# Altium schematic sheet STM32G4_4008_brushless_motor.SchDoc
size A3
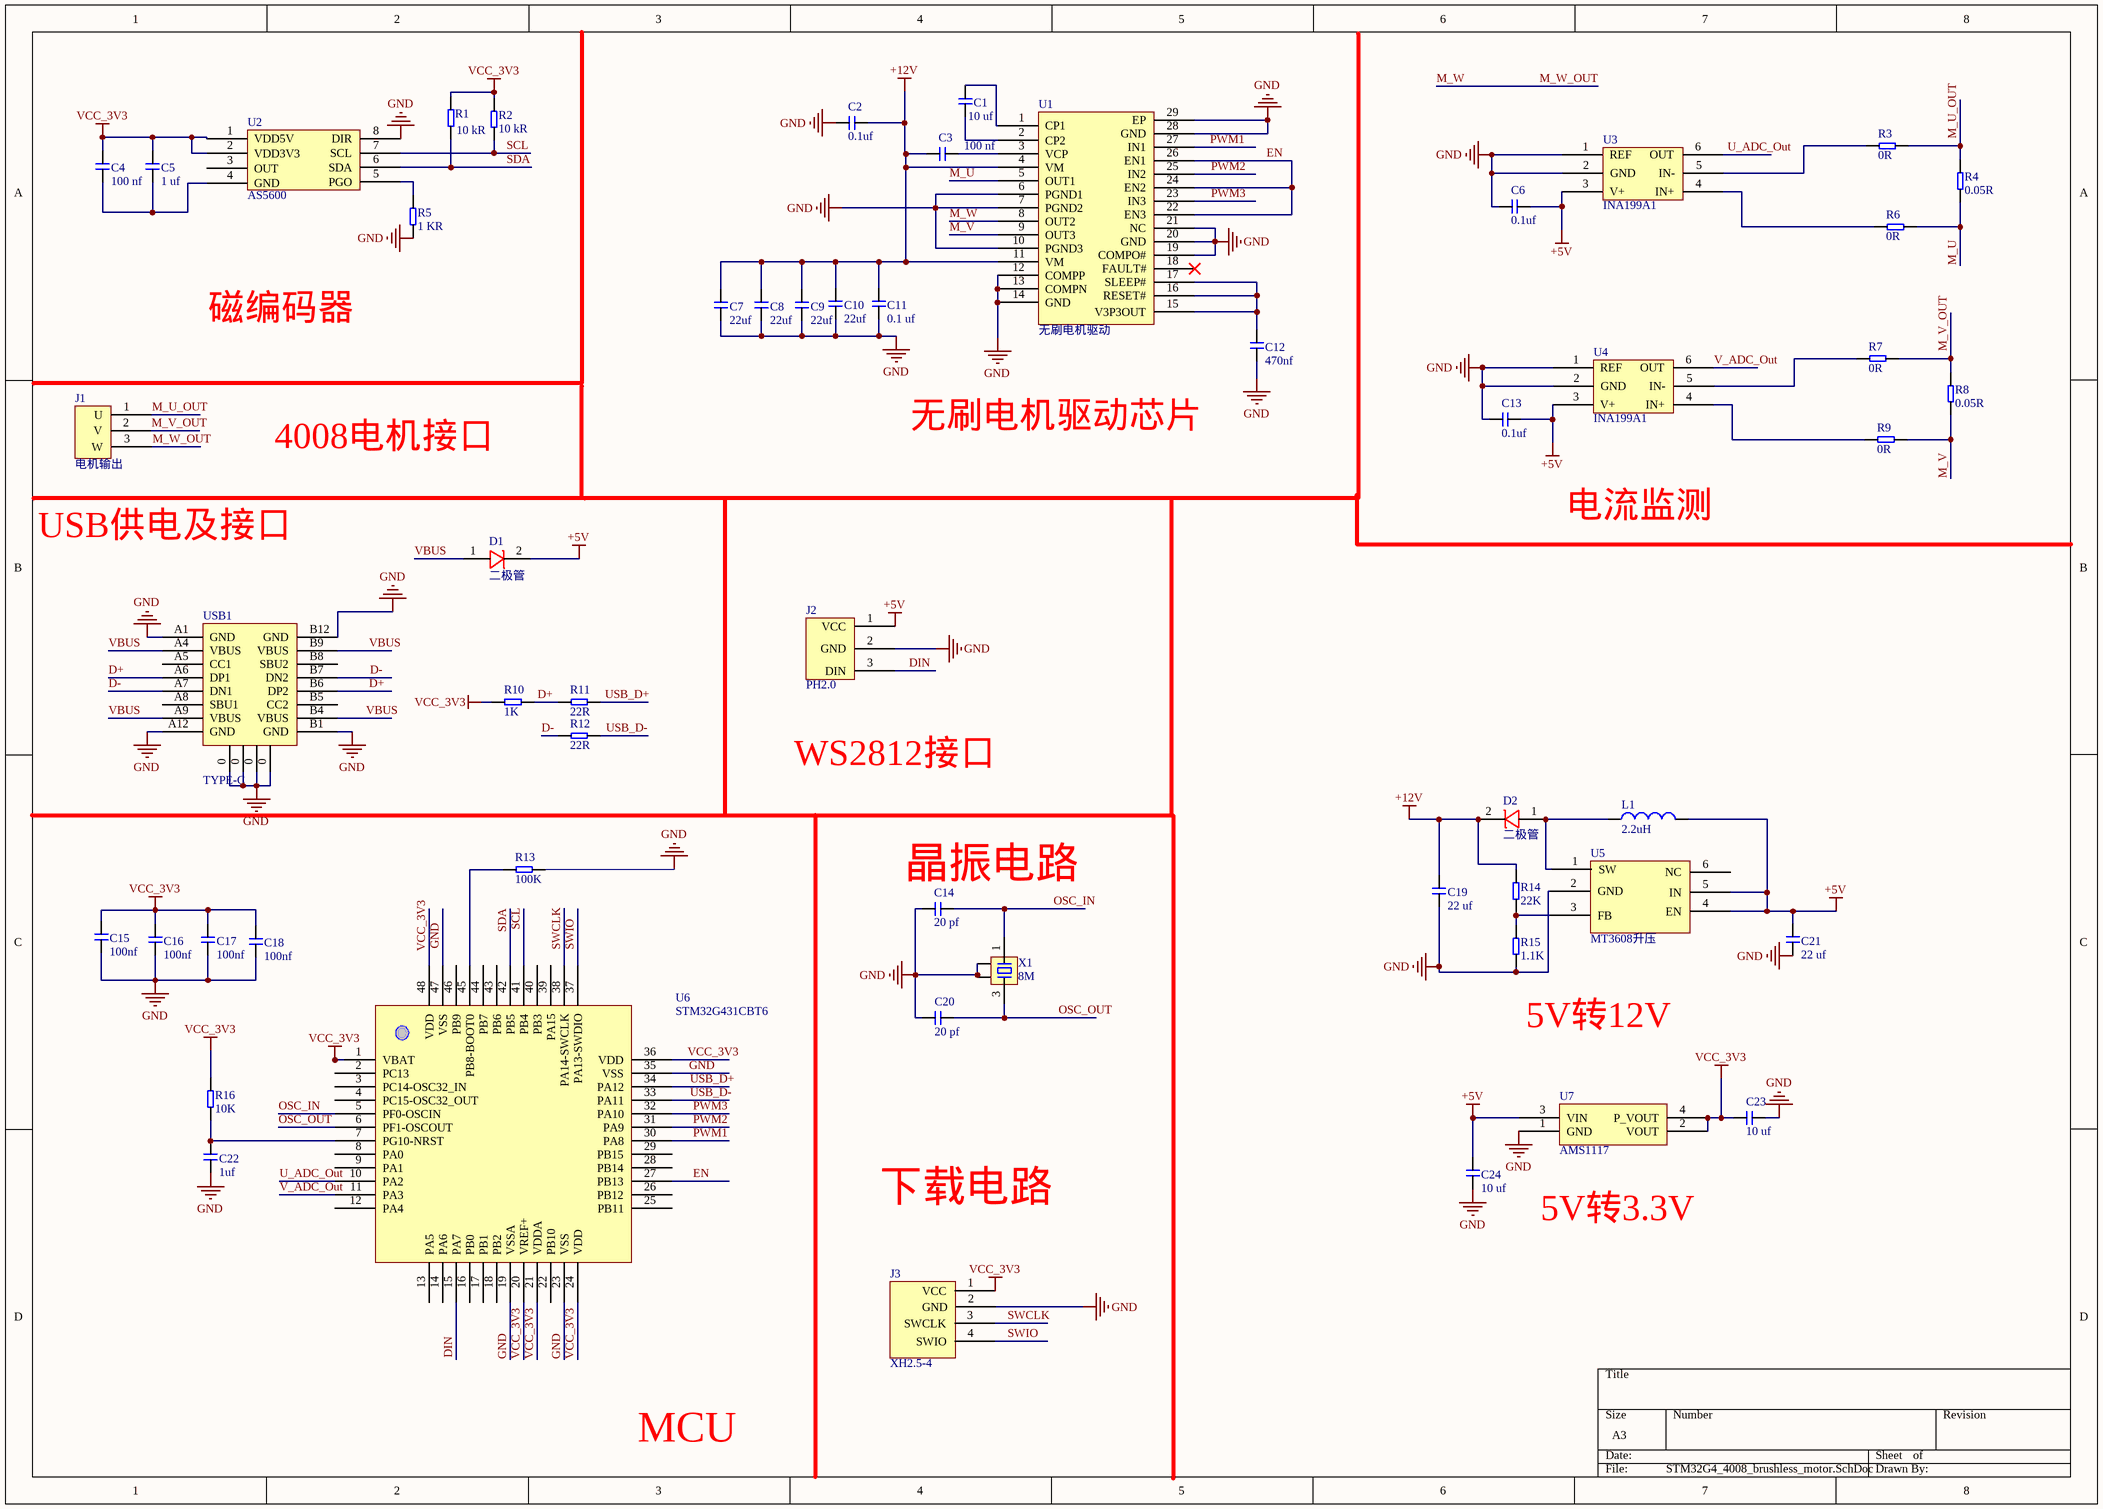
[diagram p0: STM32G4_4008_brushless_motor.SchDoc]

## Parts
C1  10 uf  [C 0603]
C2  0.1uf  [C 0603]
C3  100 nf  [C 0603]
C4  100 nf  [C 0603]
C5  1 uf  [C 0603]
C6  0.1uf  [C 0603]
C7  22uf  [C 0603]
C8  22uf  [C 0603]
C9  22uf  [C 0603]
C10  22uf  [C 0603]
C11  0.1 uf  [C 0603]
C12  470nf  [C 0603]
C13  0.1uf  [C 0603]
C14  20 pf  [C 0603]
C15  100nf  [C 0603]
C16  100nf  [C 0603]
C17  100nf  [C 0603]
C18  100nf  [C 0603]
C19  22 uf  [C 0603]
C20  20 pf  [C 0603]
C21  22 uf  [C 0603]
C22  1uf  [C 0603]
C23  10 uf  [C 0603]
C24  10 uf  [C 0603]
D1  二极管  [SMA]
D2  二极管  [SMA]
J1  电机输出  [SH1.0-WT-3P]
J2  PH2.0  [PH2.0-WI-3P]
J3  XH2.5-4  [HDR2.54-M-LI-4P]
L1  2.2uH  [L-SMD-0630]
R1  10 kR  [R 0603]
R2  10 kR  [R 0603]
R3  0R  [R 0603]
R4  0.05R  [R 2512-HP_L]
R5  1 KR  [R 0603]
R6  0R  [R 0603]
R7  0R  [R 0603]
R8  0.05R  [R 2512-HP_L]
R9  0R  [R 0603]
R10  1K  [R 0603]
R11  22R  [R 0603]
R12  22R  [R 0603]
R13  100K  [R 0603]
R14  22K  [R 0603]
R15  1.1K  [R 0603]
R16  10K  [R 0603]
U1  无刷电机驱动  [TSSOP28_n]
U2  AS5600  [SOP8_N]
U3  INA199A1  [SOT36-3N]
U4  INA199A1  [SOT36-3N]
U5  MT3608升压  [SOT23-6L]
U6  STM32G431CBT6  [TQFP48 7x7_L]
U7  AMS1117  [SOT223_N]
USB1  TYPE-C  [USB-C-SMD_TYPE-C-USB-5]
X1  8M  [OSC 3225-4P]

## Nets
+5V: C6.2 C13.2 C21.1 C24.1 D1.2 J2.1(VCC) L1.2 U3.3(V+) U4.3(V+) U5.4(EN) U5.5(IN) U7.3(VIN)
+12V: C2.2 C3.2 C7.1 C8.1 C9.1 C10.1 C11.1 C19.1 D2.2 R14.2 U1.4(VM) U1.11(VM)
GND: C2.1 C6.1 C7.2 C8.2 C9.2 C10.2 C11.2 C12.2 C13.1 C14.2 C15.2 C16.2 C17.2 C18.2 C19.2 C20.2 C21.2 C22.2 C23.1 C24.2 J2.2(GND) J3.2(GND) R5.1 R13.2 R15.1 U1.6(PGND1) U1.7(PGND2) U1.10(PGND3) U1.12(COMPP) U1.13(COMPN) U1.14(GND) U1.19(COMPO#) U1.20(GND) U1.21(NC) U1.28(GND) U1.29(EP) U2.8(DIR) U3.1(REF) U3.2(GND) U4.1(REF) U4.2(GND) U5.2(GND) U6.19(VSSA) U6.23(VSS) U6.35(VSS) U6.47(VSS) U7.1(GND) USB1.0 USB1.A1(GND) USB1.A12(GND) USB1.B1(GND) USB1.B12(GND) X1.2 X1.4
VCC_3V3: C4.1 C5.1 C15.1 C16.1 C17.1 C18.1 C23.2 J3.1(VCC) R1.2 R2.2 R10.2 R16.1 U2.1(VDD5V) U2.2(VDD3V3) U6.1(VBAT) U6.20(VREF+) U6.21(VDDA) U6.24(VDD) U6.36(VDD) U6.48(VDD) U7.2(VOUT) U7.4(P_VOUT)
D+: R10.1 R11.1 USB1.A6(DP1) USB1.B6(DP2)
D-: R12.1 USB1.A7(DN1) USB1.B7(DN2)
DIN: J2.3(DIN) U6.15(PA7)
EN: U1.22(EN3) U1.24(EN2) U1.26(EN1) U6.27(PB13)
M_U: R4.2 R6.1 U1.5(OUT1)
M_U_OUT: J1.1(U) R3.1 R4.1
M_V: R8.2 R9.1 U1.9(OUT3)
M_V_OUT: J1.2(V) R7.1 R8.1
M_W: J1.3(W) U1.8(OUT2)  [also labelled M_W_OUT]
OSC_IN: C14.1 U6.5(PF0-OSCIN) X1.1
OSC_OUT: C20.1 U6.6(PF1-OSCOUT) X1.3
PWM1: U1.27(IN1) U6.30(PA8)
PWM2: U1.25(IN2) U6.31(PA9)
PWM3: U1.23(IN3) U6.32(PA10)
SCL: R2.1 U2.7(SCL) U6.41(PB4)
SDA: R1.1 U2.6(SDA) U6.42(PB5)
SWCLK: J3.3(SWCLK) U6.38(PA14-SWCLK)
SWIO: J3.4(SWIO) U6.37(PA13-SWDIO)
U_ADC_Out: U3.6(OUT) U6.10(PA2)
USB_D+: R11.2 U6.34(PA12)
USB_D-: R12.2 U6.33(PA11)
V_ADC_Out: U4.6(OUT) U6.11(PA3)
VBUS: D1.1 USB1.A4(VBUS) USB1.A9(VBUS) USB1.B4(VBUS) USB1.B9(VBUS)
NetC1_1: C1.1 U1.1(CP1)
NetC1_2: C1.2 U1.2(CP2)
NetC3_1: C3.1 U1.3(VCP)
NetC4_2: C4.2 C5.2 U2.4(GND)
NetC12_1: C12.1 U1.15(V3P3OUT) U1.16(RESET#) U1.17(SLEEP#)
NetC22_1: C22.1 R16.2 U6.7(PG10-NRST)
NetD2_1: D2.1 L1.1 U5.1(SW)
NetR3_2: R3.2 U3.5(IN-)
NetR5_2: R5.2 U2.5(PGO)
NetR6_2: R6.2 U3.4(IN+)
NetR7_2: R7.2 U4.5(IN-)
NetR9_2: R9.2 U4.4(IN+)
NetR13_1: R13.1 U6.45(PB8-BOOT0)
NetR14_1: R14.1 R15.2 U5.3(FB)

Not connected (* = marked no-connect by the designer): U1 18(FAULT#)*; U2 3(OUT); U5 6(NC); U6 2(PC13) 3(PC14-OSC32_IN) 4(PC15-OSC32_OUT) 8(PA0) 9(PA1) 12(PA4) 13(PA5) 14(PA6) 16(PB0) 17(PB1) 18(PB2) 22(PB10) 25(PB11) 26(PB12) 28(PB14) 29(PB15) 39(PA15) 40(PB3) 43(PB6) 44(PB7) 46(PB9); USB1 A5(CC1) A8(SBU1) B5(CC2) B8(SBU2)

## Notes on the sheet
- 磁编码器
- 4008电机接口
- 无刷电机驱动芯片
- USB供电及接口
- 电流监测
- WS2812接口
- (near C14) 晶振电路
- (near R15) 5V转12V
- 下载电路
- 5V转3.3V
- MCU

## Library data of the parts
C1-C24 = 电容C: 电容0603
L1 = L: 小功率贴片电感; 版权归属: 源创客; BOM名称: 小功率贴片电感; 学习资源: www.ooocke.com
R1-R16 = 电阻R: 电阻0603
U1 = DRV8313
U3 U4 = INA199A1: 电流检测
U5 = MT3608
U7 = 5V转3.3V: 电平转换模块
X1 = XTAL-4P: 4脚无源晶振; 版权归属: 源创客; BOM名称: 4脚无源晶振; 学习资源: www.ooocke.com